# EAGLE schematic Mixer Block Diagram (EAGLE 9.1.3)
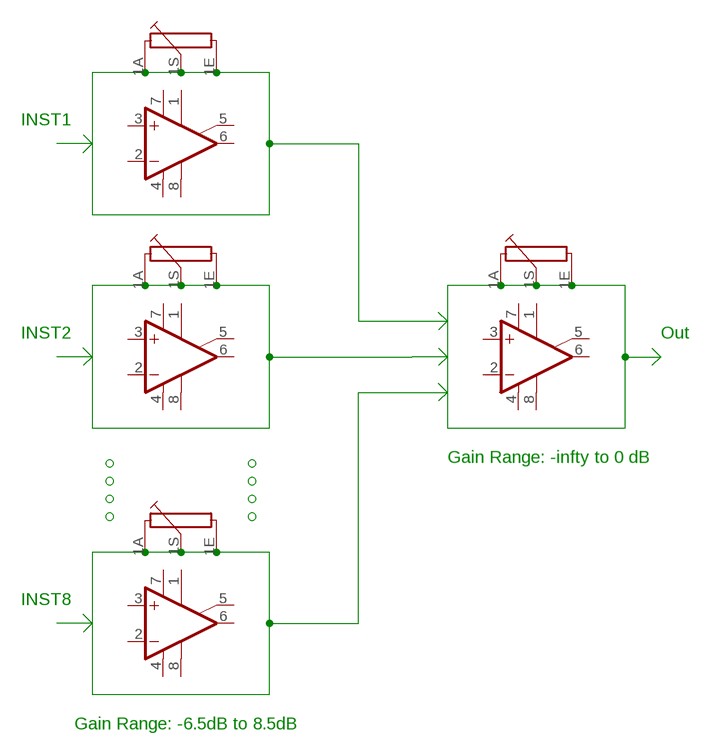
[diagram p0: schematic, sheet 1]

## Parts
IC1  LM741D  [SO08]
IC2  LM741D  [SO08]
IC3  LM741D  [SO08]
IC4  LM741D  [SO08]
R1  PC16S  [PC16S]
R2  PC16S  [PC16S]
R3  PC16S  [PC16S]
R4  PC16S  [PC16S]

## Nets
N$3: R1.1A R1.1E R1.1S R2.1A R2.1E R2.1S R3.1A R3.1E R3.1S R4.1A R4.1E R4.1S
Unconnected: IC1.1(ON1) IC1.2(-IN) IC1.3(+IN) IC1.5(ON2) IC1.6(OUT) IC1.8(OPT) IC2.1(ON1) IC2.2(-IN) IC2.3(+IN) IC2.5(ON2) IC2.6(OUT) IC2.8(OPT) IC3.1(ON1) IC3.2(-IN) IC3.3(+IN) IC3.5(ON2) IC3.6(OUT) IC3.8(OPT) IC4.1(ON1) IC4.2(-IN) IC4.3(+IN) IC4.5(ON2) IC4.6(OUT) IC4.8(OPT)

## Notes on the sheet
- INST1
- INST2 | Out
- Gain Range: -infty to 0 dB
- INST8
- Gain Range: -6.5dB to 8.5dB

## Power pins joined to a net without a drawn wire
V+: IC1.7(V+) IC2.7(V+) IC3.7(V+) IC4.7(V+)
V-: IC1.4(V-) IC2.4(V-) IC3.4(V-) IC4.4(V-)

## Library data of the parts
IC1-IC4 = linear:*741: OP AMP
R1-R4 = piher:PC16S: POTENTIOMETER single carbon potentiometer, 16 mm, S3ROH; OC_FARNELL: 4452940; OC_NEWARK: unknown